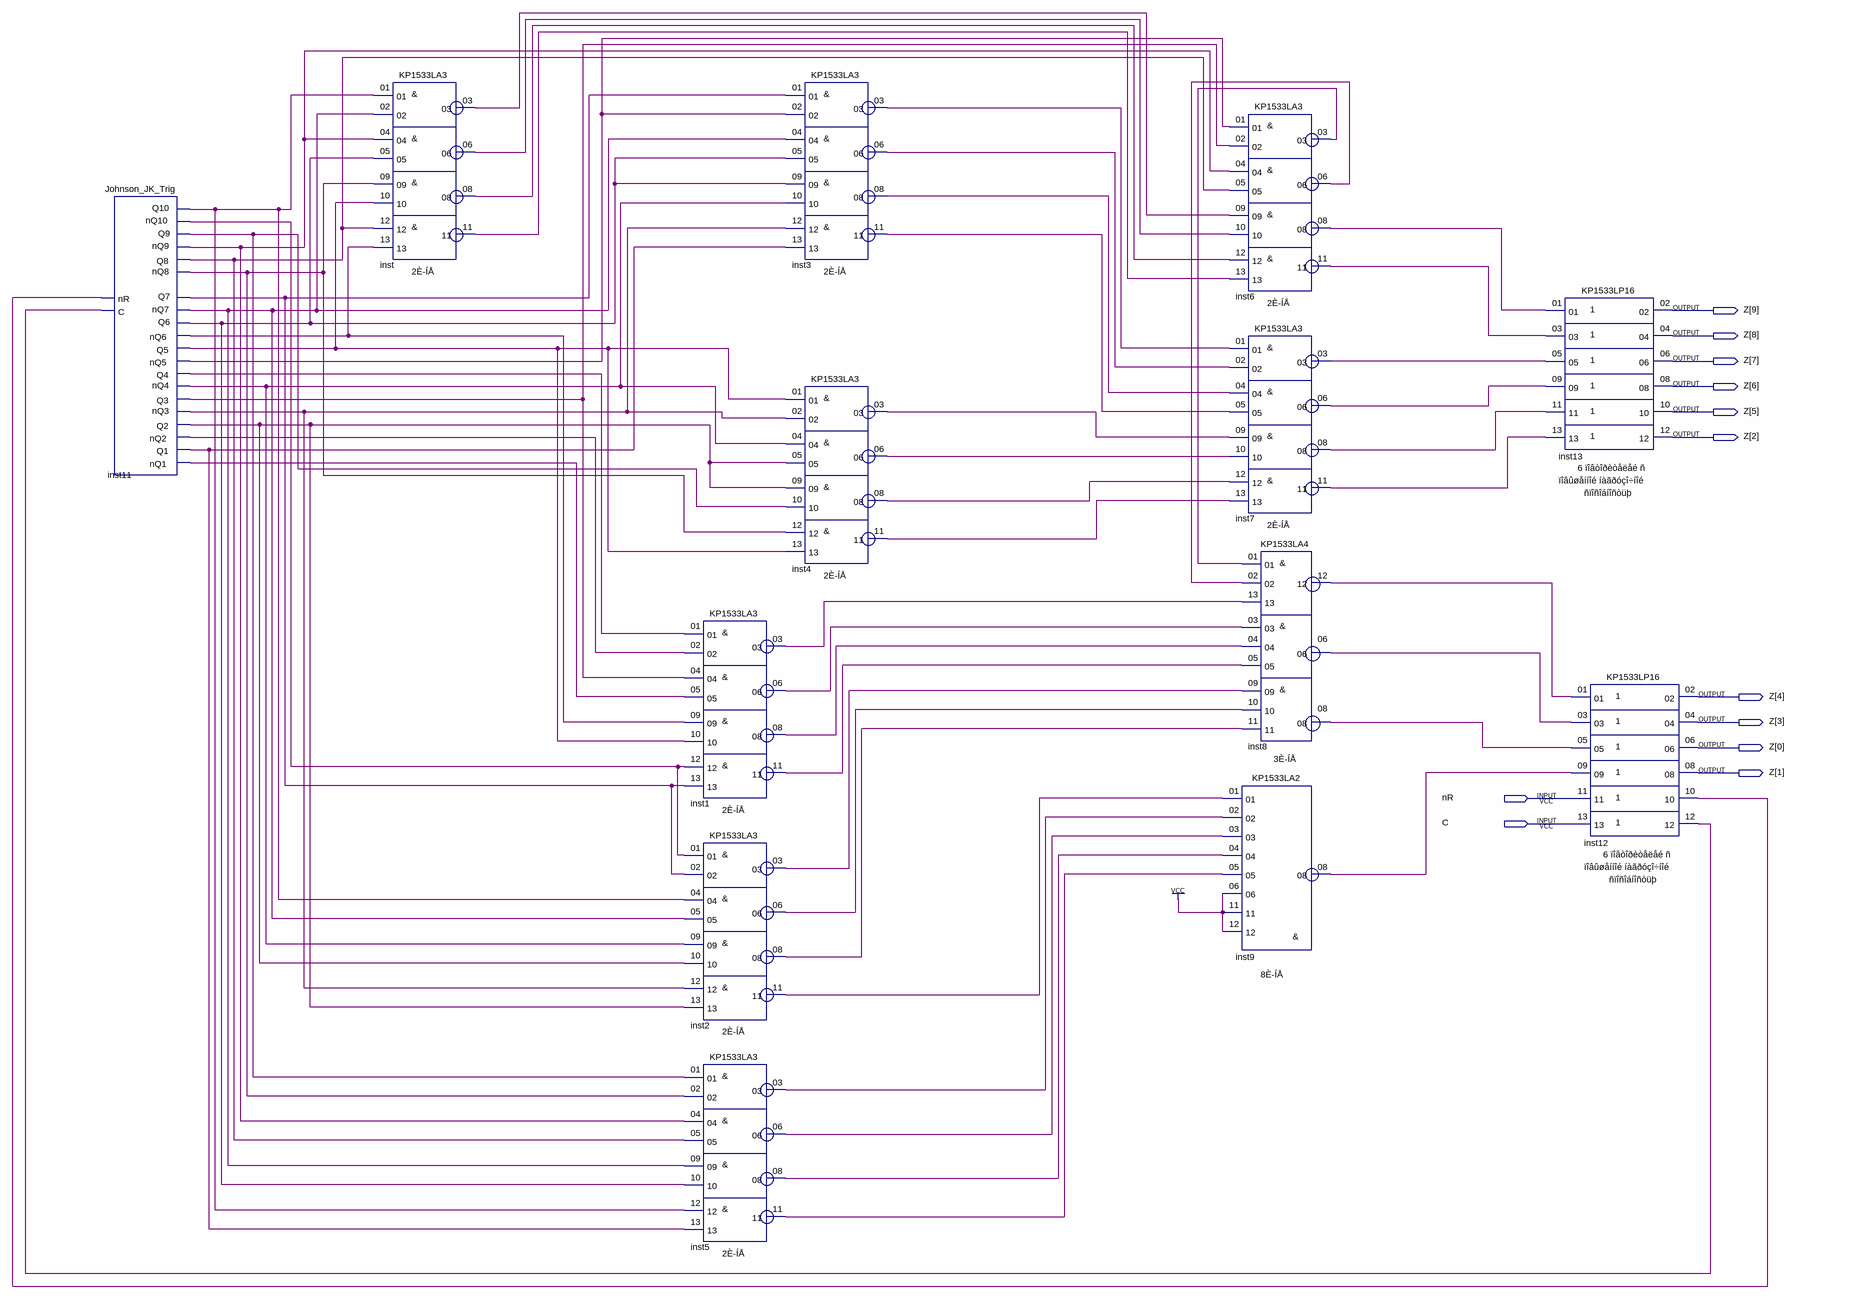
[diagram p0: schematic sheet]
// Quartus schematic number_generator.bdf as structural Verilog: 13 symbols, 12 pins
module number_generator (
  input  nR,
  input  C,
  output [9:0] Z
);

  wire inst1_03, inst1_06, inst1_08, inst1_11, inst2_03, inst2_06, inst2_08, inst2_11, inst3_03, inst3_06,
       inst3_08, inst3_11, inst4_03, inst4_06, inst4_08, inst4_11, inst5_03, inst5_06, inst5_08, inst5_11,
       inst6_03, inst6_06, inst6_08, inst6_11, inst7_03, inst7_06, inst7_08, inst7_11, inst8_06, inst8_08,
       inst8_12, inst9_08, inst11_nq1, inst11_nq2, inst11_nq3, inst11_nq4, inst11_nq5, inst11_nq6,
       inst11_nq7, inst11_nq8, inst11_nq9, inst11_nq10, inst11_q1, inst11_q2, inst11_q3, inst11_q4,
       inst11_q5, inst11_q6, inst11_q7, inst11_q8, inst11_q9, inst11_q10, inst12_10, inst12_12, inst_03,
       inst_06, inst_08, inst_11;

  Johnson_JK_Trig inst11 (
    .nR(inst12_10), .C(inst12_12), .Q10(inst11_q10), .Q8(inst11_q8), .Q6(inst11_q6), .Q4(inst11_q4),
    .Q2(inst11_q2), .nQ10(inst11_nq10), .nQ8(inst11_nq8), .nQ6(inst11_nq6), .nQ4(inst11_nq4),
    .nQ2(inst11_nq2), .Q9(inst11_q9), .Q7(inst11_q7), .Q5(inst11_q5), .Q3(inst11_q3), .Q1(inst11_q1),
    .nQ9(inst11_nq9), .nQ7(inst11_nq7), .nQ5(inst11_nq5), .nQ3(inst11_nq3), .nQ1(inst11_nq1));
  KP1533LA3 inst (
    .\01 (inst11_q10), .\02 (inst11_nq7), .\04 (inst11_nq9), .\05 (inst11_q6), .\09 (inst11_nq8),
    .\10 (inst11_q5), .\12 (inst11_q8), .\13 (inst11_nq6), .\03 (inst_03), .\06 (inst_06), .\08 (inst_08),
    .\11 (inst_11));
  KP1533LA3 inst1 (
    .\01 (inst11_q4), .\02 (inst11_nq2), .\04 (inst11_q3), .\05 (inst11_nq1), .\09 (inst11_nq6),
    .\10 (inst11_q5), .\12 (inst11_nq10), .\13 (inst11_q7), .\03 (inst1_03), .\06 (inst1_06),
    .\08 (inst1_08), .\11 (inst1_11));
  KP1533LA3 inst2 (
    .\01 (inst11_nq10), .\02 (inst11_q7), .\04 (inst11_q10), .\05 (inst11_nq7), .\09 (inst11_nq4),
    .\10 (inst11_q2), .\12 (inst11_nq3), .\13 (inst11_q2), .\03 (inst2_03), .\06 (inst2_06), .\08 (inst2_08),
    .\11 (inst2_11));
  KP1533LA3 inst5 (
    .\01 (inst11_q9), .\02 (inst11_nq8), .\04 (inst11_nq9), .\05 (inst11_q8), .\09 (inst11_nq7),
    .\10 (inst11_q6), .\12 (inst11_q10), .\13 (inst11_q1), .\03 (inst5_03), .\06 (inst5_06), .\08 (inst5_08),
    .\11 (inst5_11));
  KP1533LA3 inst3 (
    .\01 (inst11_q7), .\02 (inst11_nq5), .\04 (inst11_nq7), .\05 (inst11_q6), .\09 (inst11_q6),
    .\10 (inst11_nq4), .\12 (inst11_nq3), .\13 (inst11_q1), .\03 (inst3_03), .\06 (inst3_06),
    .\08 (inst3_08), .\11 (inst3_11));
  KP1533LA3 inst4 (
    .\01 (inst11_q5), .\02 (inst11_nq3), .\04 (inst11_nq4), .\05 (inst11_q2), .\09 (inst11_q2),
    .\10 (inst11_q9), .\12 (inst11_nq8), .\13 (inst11_q5), .\03 (inst4_03), .\06 (inst4_06), .\08 (inst4_08),
    .\11 (inst4_11));
  KP1533LA3 inst6 (
    .\01 (inst11_nq5), .\02 (inst11_q3), .\04 (inst11_nq9), .\05 (inst11_q8), .\09 (inst_03), .\10 (inst_06),
    .\12 (inst_08), .\13 (inst_11), .\03 (inst6_03), .\06 (inst6_06), .\08 (inst6_08), .\11 (inst6_11));
  KP1533LA3 inst7 (
    .\01 (inst3_03), .\02 (inst3_06), .\04 (inst3_08), .\05 (inst3_11), .\09 (inst4_03), .\10 (inst4_06),
    .\12 (inst4_08), .\13 (inst4_11), .\03 (inst7_03), .\06 (inst7_06), .\08 (inst7_08), .\11 (inst7_11));
  KP1533LA4 inst8 (
    .\01 (inst6_03), .\02 (inst6_06), .\13 (inst1_03), .\03 (inst1_06), .\04 (inst1_08), .\05 (inst1_11),
    .\09 (inst2_03), .\10 (inst2_06), .\11 (inst2_08), .\12 (inst8_12), .\06 (inst8_06), .\08 (inst8_08));
  KP1533LA2 inst9 (
    .\01 (inst2_11), .\02 (inst5_03), .\03 (inst5_06), .\04 (inst5_08), .\05 (inst5_11), .\06 (1'b1),
    .\11 (1'b1), .\12 (1'b1), .\08 (inst9_08));
  KP1533LP16 inst13 (
    .\01 (inst6_08), .\03 (inst6_11), .\05 (inst7_03), .\09 (inst7_06), .\11 (inst7_08), .\13 (inst7_11),
    .\02 (Z[9]), .\04 (Z[8]), .\06 (Z[7]), .\08 (Z[6]), .\10 (Z[5]), .\12 (Z[2]));
  KP1533LP16 inst12 (
    .\01 (inst8_12), .\03 (inst8_06), .\05 (inst8_08), .\09 (inst9_08), .\11 (nR), .\13 (C), .\02 (Z[4]),
    .\04 (Z[3]), .\06 (Z[0]), .\08 (Z[1]), .\10 (inst12_10), .\12 (inst12_12));
endmodule
